# Altium schematic sheet LED_Driver.SchDoc
size A
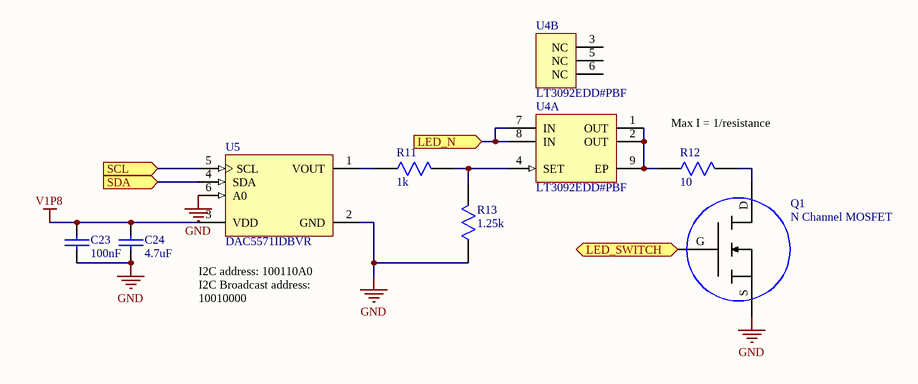
[diagram p0: LED_Driver.SchDoc]

## Parts
C23  100nF  [SMD CAP 0402]
C24  4.7uF  [SMD CAP 0402]
Q1  N Channel MOSFET  [NTK3134N]
R11  1k  [SMD RES 0402]
R12  10  [SMD RES 0402]
R13  1.25k  [SMD RES 0402]
U4  LT3092EDD#PBF  [LT-DD-8_V]  (parts A,B of 2)
U5  DAC5571IDBVR  [TI-DBV6_M]

## Ports
LED_N (in), LED_SWITCH (in), SCL (in), SDA (in)

## Nets
GND: C23.1 C24.1 Q1.S R13.0 U5.2(GND) U5.6(A0)
V1P8: C23.0 C24.0 U5.3(VDD)
LED_N: U4.7(IN) U4.8(IN) ; port LED_N
LED_SWITCH: Q1.G ; port LED_SWITCH
SCL: U5.5(SCL) ; port SCL
SDA: U5.4(SDA) ; port SDA
NetQ1_D: Q1.D R12.1
NetR11_0: R11.0 U5.1(VOUT)
NetR11_1: R11.1 R13.1 U4.4(SET)
NetR12_0: R12.0 U4.1(OUT) U4.2(OUT) U4.9(EP)

Not connected (* = marked no-connect by the designer): U4 3(NC) 5(NC) 6(NC)

## Notes on the sheet
- (near R12) Max I = 1/resistance
- (near U5) I2C address: 100110A0
  I2C Broadcast address: 10010000

## Library data of the parts
C23 C24 = Capacitor: Value: C?
R11-R13 = Resistor: Value: ?
U4 = LT3092EDD#PBF: 200 mA Two-Terminal Programmable Current Source, 0.3 mA Isupply, 8-pin SON (DD-8), -40 to 125 degC, Pb-Free; Manufacturer: Linear Technology; Extended Temp: E, I, MP; Initial Accuracy(%): 1; Isupply(mA): 0.3; Output Current Range: 0.5 mA to 200 mA; Vin Max(V): 40; Vin Min(V): 1.2; DatasheetVersion: Rev. B; PackageVersion: Jun-10; PackageReference: DD-8; PackageDescription: 8-Pin Plastic DFN, Body 3 x 3 mm, Pitch 0.5 mm; Supplier 1: Digi-Key; Supplier Part Number 1: LT3092EDD#PBF-ND; Supplier 2: Farnell; Supplier Part Number 2: 2295468; Supplier 3: Newark; Supplier Part Number 3: 72R5810; RoHS: TRUE; Mounting Technology: Surface Mount; Code_JEDEC: MO-229; PartNumber: LT3092EDD#PBF; ComponentLink1Description: Manufacturer URL; ComponentLink1URL: http://www.linear.com/; ComponentLink2Description: Datasheet; ComponentLink2URL: http://cds.linear.com/docs/en/datasheet/3092fb.pdf; ComponentLink3Description: Package Specification; ComponentLink3URL: http://cds.linear.com/docs/en/packaging/DFN_8_05-08-1698.pdf
U5 = DAC5571IDBVR: Low-Power, 8-Bit DAC with High-Speed I2C Input, -40 to 105 degC, 6-pin SOT23 (DBV6), Green (RoHS & no Sb/Br); Manufacturer: Texas Instruments; DAC Channels: 1; DNL(Max)(+/-LSB): 0.25; Interface: Serial I2C; Power Consumption(Typ)(mW): 0.4; Resolution(Bits): 8; SubFamily: Precision DAC (=<10MSPS); DatasheetVersion: SLAS405A; PackageVersion: 4073253-5/K, 03/2006; PackageReference: DBV6; PackageDescription: 6-Pin Plastic Small Outline, Body 1.6 x 2.9 mm, Pitch 0.95 mm; Supplier 1: Digi-Key; Supplier Part Number 1: DAC5571IDBVR-ND; Supplier 2: Mouser; Supplier Part Number 2: 595-DAC5571IDBVR; Eco-Plan: Green (RoHS & no Sb/Br); INL(Max)(+/-LSB): 1; Settling Time(us): 8; Mounting Technology: Surface Mount; Code_JEDEC: MO-178; PartNumber: DAC5571IDBVR; ComponentLink1Description: Manufacturer URL; ComponentLink1URL: http://www.ti.com/; ComponentLink2Description: Datasheet; ComponentLink2URL: http://www.ti.com/general/docs/lit/getliterature.tsp?genericPartNumber=DAC5571&fileType=pdf; ComponentLink3Description: Package Specification; ComponentLink3URL: http://www.ti.com/litv/pdf/mpds026h